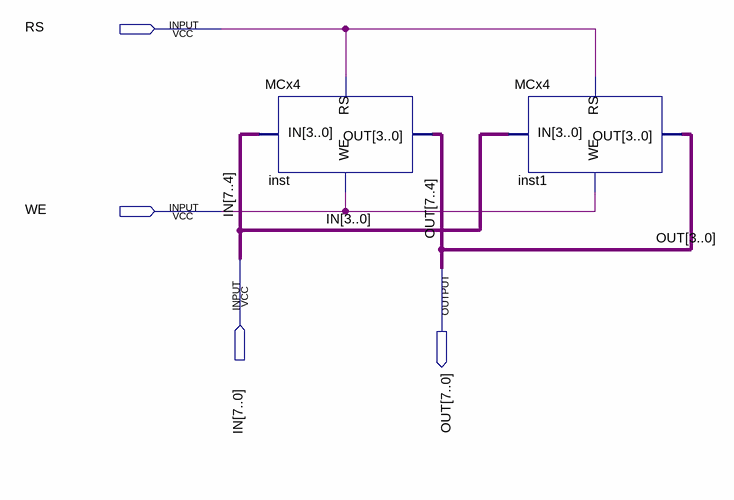
[diagram p0: schematic sheet]
// Quartus schematic MCx8.bdf as structural Verilog: 2 symbols, 4 pins
module MCx8 (
  input  RS,
  input  WE,
  input  [7:0] IN,
  output [7:0] OUT
);

  MCx4 inst (.RS(RS), .WE(WE), .IN(IN[7:4]), .OUT(OUT[7:4]));
  MCx4 inst1 (.RS(RS), .WE(WE), .IN(IN[3:0]), .OUT(OUT[3:0]));
endmodule
